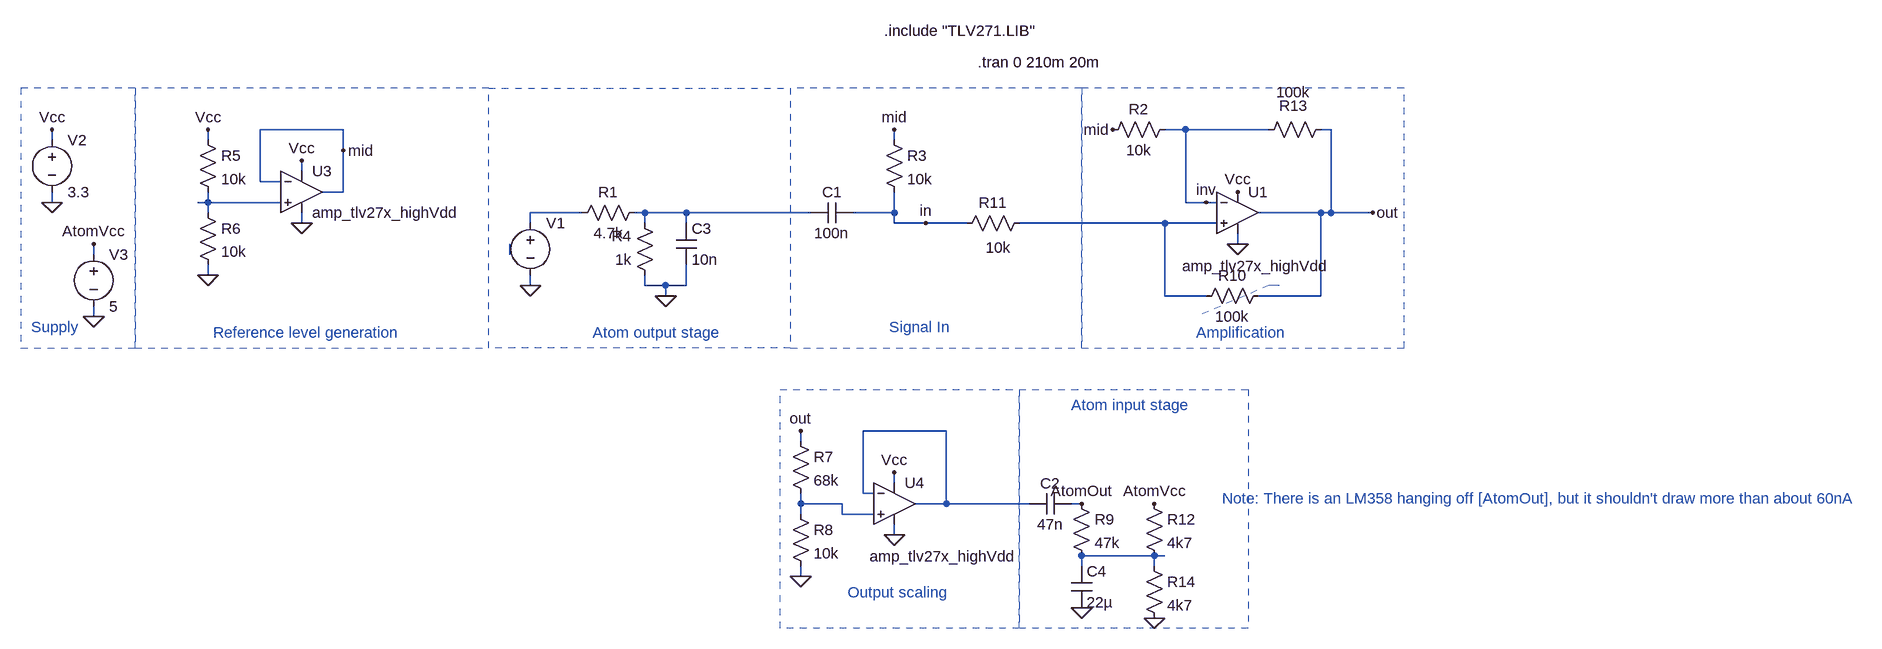
[diagram p0: schematic Amplifier.asc]
Amplifier.asc, the LTspice schematic file:
Version 4
SHEET 1 1984 692
WIRE -784 -96 -912 -96
WIRE 512 -96 480 -96
WIRE 640 -96 512 -96
WIRE 736 -96 720 -96
WIRE -1232 -80 -1232 -96
WIRE -992 -80 -992 -96
WIRE 64 -80 64 -96
WIRE -784 -64 -784 -96
WIRE -848 -32 -848 -48
WIRE -912 -16 -912 -96
WIRE -880 -16 -912 -16
WIRE -784 0 -784 -64
WIRE -784 0 -816 0
WIRE -1232 16 -1232 0
WIRE -992 16 -992 0
WIRE -992 16 -1008 16
WIRE -880 16 -992 16
WIRE 512 16 512 -96
WIRE 544 16 512 16
WIRE 560 16 544 16
WIRE -992 32 -992 16
WIRE -416 32 -496 32
WIRE -320 32 -336 32
WIRE -256 32 -320 32
WIRE -64 32 -256 32
WIRE 64 32 64 0
WIRE 64 32 0 32
WIRE 720 32 624 32
WIRE 736 32 736 -96
WIRE 736 32 720 32
WIRE 800 32 736 32
WIRE -848 48 -848 32
WIRE -496 48 -496 32
WIRE -320 48 -320 32
WIRE -256 48 -256 32
WIRE 64 48 64 32
WIRE 112 48 64 48
WIRE 176 48 112 48
WIRE 480 48 256 48
WIRE 560 48 480 48
WIRE 592 80 592 64
WIRE -1168 96 -1168 80
WIRE -528 96 -528 80
WIRE -992 128 -992 112
WIRE -496 144 -496 128
WIRE -320 144 -320 128
WIRE -288 144 -320 144
WIRE -256 144 -256 112
WIRE -256 144 -288 144
WIRE -288 160 -288 144
WIRE 480 160 480 48
WIRE 544 160 480 160
WIRE 720 160 720 32
WIRE 720 160 624 160
WIRE -1168 192 -1168 176
WIRE 144 368 16 368
WIRE -80 384 -80 368
WIRE 64 448 64 432
WIRE 16 464 16 368
WIRE 32 464 16 464
WIRE -80 480 -80 464
WIRE -16 480 -80 480
WIRE 144 480 144 368
WIRE 144 480 96 480
WIRE 272 480 144 480
WIRE 352 480 336 480
WIRE -80 496 -80 480
WIRE -16 496 -16 480
WIRE 32 496 -16 496
WIRE 64 528 64 512
WIRE 464 560 352 560
WIRE 480 560 464 560
WIRE 352 576 352 560
WIRE 464 576 464 560
WIRE -80 592 -80 576
FLAG 592 0 Vcc
FLAG 592 80 0
FLAG -496 144 0
FLAG -1232 16 0
FLAG -1232 -96 Vcc
FLAG 64 -96 mid
FLAG -992 -96 Vcc
FLAG -992 128 0
FLAG -784 -64 mid
FLAG 800 32 out
FLAG 544 16 inv
FLAG 112 48 in
FLAG 400 -96 mid
FLAG -848 -48 Vcc
FLAG -848 48 0
FLAG 64 432 Vcc
FLAG 64 528 0
FLAG -80 592 0
FLAG -80 368 out
FLAG -288 160 0
FLAG 352 640 0
FLAG -1168 192 0
FLAG -1168 80 AtomVcc
FLAG 464 656 0
FLAG 464 480 AtomVcc
FLAG 352 480 AtomOut
SYMBOL Opamps\\opamp2 592 -32 R0
WINDOW 3 -85 146 Left 2
SYMATTR Value amp_tlv27x_highVdd
SYMATTR InstName U1
SYMBOL voltage -1232 -96 R0
WINDOW 123 0 0 Left 2
WINDOW 39 0 0 Left 2
SYMATTR InstName V2
SYMATTR Value 3.3
SYMBOL res 384 -80 R270
WINDOW 0 32 56 VTop 2
WINDOW 3 0 56 VBottom 2
SYMATTR InstName R2
SYMATTR Value 10k
SYMBOL voltage -496 32 R0
WINDOW 3 -117 54 Invisible 2
WINDOW 123 0 0 Left 2
WINDOW 39 0 0 Left 2
SYMATTR Value PULSE(0 5 20m 10n 10n 400u 800u 250)
SYMATTR InstName V1
SYMBOL cap 0 16 R90
WINDOW 0 0 32 VBottom 2
WINDOW 3 32 32 VTop 2
SYMATTR InstName C1
SYMATTR Value 100n
SYMBOL res 48 -96 R0
SYMATTR InstName R3
SYMATTR Value 10k
SYMBOL res -1008 -96 R0
SYMATTR InstName R5
SYMATTR Value 10k
SYMBOL res -1008 16 R0
SYMATTR InstName R6
SYMATTR Value 10k
SYMBOL Opamps\\opamp2 -848 -64 R0
SYMATTR InstName U3
SYMATTR Value amp_tlv27x_highVdd
SYMBOL Opamps\\opamp2 64 416 R0
WINDOW 3 -38 145 Left 2
SYMATTR Value amp_tlv27x_highVdd
SYMATTR InstName U4
SYMBOL res -96 368 R0
SYMATTR InstName R7
SYMATTR Value 68k
SYMBOL res -96 480 R0
SYMATTR InstName R8
SYMATTR Value 10k
SYMBOL cap 336 464 R90
WINDOW 0 0 32 VBottom 2
WINDOW 3 32 32 VTop 2
SYMATTR InstName C2
SYMATTR Value 47n
SYMBOL res 336 464 R0
SYMATTR InstName R9
SYMATTR Value 47k
SYMBOL res 640 144 R90
WINDOW 0 0 56 VBottom 2
WINDOW 3 32 56 VTop 2
SYMATTR InstName R10
SYMATTR Value 100k
SYMBOL res 272 32 R90
WINDOW 0 0 56 VBottom 2
WINDOW 3 38 48 VTop 2
SYMATTR InstName R11
SYMATTR Value 10k
SYMBOL res 736 -112 R90
WINDOW 0 -5 58 VBottom 2
WINDOW 3 -57 58 VTop 2
SYMATTR InstName R13
SYMATTR Value 100k
SYMBOL res -320 16 R90
WINDOW 0 0 56 VBottom 2
WINDOW 3 32 56 VTop 2
SYMATTR InstName R1
SYMATTR Value 4.7k
SYMBOL res -304 144 R180
WINDOW 0 36 76 Left 2
WINDOW 3 36 40 Left 2
SYMATTR InstName R4
SYMATTR Value 1k
SYMBOL cap -272 48 R0
SYMATTR InstName C3
SYMATTR Value 10n
SYMBOL cap 336 576 R0
SYMATTR InstName C4
SYMATTR Value 22µ
SYMBOL voltage -1168 80 R0
WINDOW 123 0 0 Left 2
WINDOW 39 0 0 Left 2
SYMATTR InstName V3
SYMATTR Value 5
SYMBOL res 448 464 R0
SYMATTR InstName R12
SYMATTR Value 4k7
SYMBOL res 448 560 R0
SYMATTR InstName R14
SYMATTR Value 4k7
TEXT 48 -248 Left 2 !.include "TLV271.LIB"
TEXT 192 -200 Left 2 !.tran 0 210m 20m
TEXT -1264 208 Left 2 ;Supply
TEXT -984 216 Left 2 ;Reference level generation
TEXT 56 208 Left 2 ;Signal In
TEXT 528 216 Left 2 ;Amplification
TEXT -8 616 Left 2 ;Output scaling
TEXT 336 328 Left 2 ;Atom input stage
TEXT -400 216 Left 2 ;Atom output stage
TEXT 568 472 Left 2 ;Note: There is an LM358 hanging off [AtomOut], but it shouldn't draw more than about 60nA
LINE Normal 640 144 528 192 2
LINE Normal 656 144 640 144 2
LINE Normal 656 144 656 144 2
RECTANGLE Normal -560 -160 -1104 240 2
RECTANGLE Normal -1280 240 -1104 -160 2
RECTANGLE Normal 352 -160 -96 240 2
RECTANGLE Normal 848 -160 352 240 2
RECTANGLE Normal 256 672 -112 304 2
RECTANGLE Normal 608 672 256 304 2
RECTANGLE Normal -96 240 -560 -160 2

The netlist it stands for:
* Amplifier.asc
XU1 N004 inv Vcc 0 out amp_tlv27x_highVdd  ; pins In+ In- V+ V- OUT
V2 Vcc 0 3.3
R2 mid inv 10k
V1 N002 0 PULSE(0 5 20m 10n 10n 400u 800u 250)
C1 in N003 100n
R3 mid in 10k
R5 Vcc N001 10k
R6 N001 0 10k
XU3 N001 mid Vcc 0 mid amp_tlv27x_highVdd  ; pins In+ In- V+ V- OUT
XU4 N007 N006 Vcc 0 N006 amp_tlv27x_highVdd  ; pins In+ In- V+ V- OUT
R7 out N007 68k
R8 N007 0 10k
C2 AtomOut N006 47n
R9 AtomOut N008 47k
R10 out N004 100k
R11 N004 in 10k
R13 out inv 100k
R1 N003 N002 4.7k
R4 0 N003 1k
C3 N003 0 10n
C4 N008 0 22µ
V3 AtomVcc 0 5
R12 AtomVcc N008 4k7
R14 N008 0 4k7
.include "TLV271.LIB"
.tran 0 210m 20m
* Supply
* Reference level generation
* Signal In
* Amplification
* Output scaling
* Atom input stage
* Atom output stage
* Note: There is an LM358 hanging off [AtomOut], but it shouldn't draw more than about 60nA
.backanno
.end